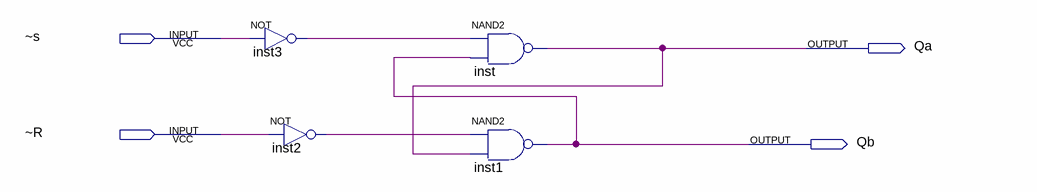
[diagram p0: schematic sheet]
// Quartus schematic step1section2.bdf as structural Verilog: 4 symbols, 4 pins
module step1section2 (
  input  \~s ,
  input  \~R ,
  output Qa,
  output Qb
);

  wire inst2_out, inst3_out;

  not inst3 (inst3_out, \~s );
  not inst2 (inst2_out, \~R );
  nand inst (Qa, inst3_out, Qb);
  nand inst1 (Qb, inst2_out, Qa);
endmodule
